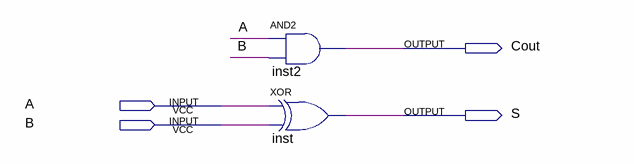
[diagram p0: schematic sheet]
// Quartus schematic HA.bdf as structural Verilog: 2 symbols, 4 pins
module HA (
  input  A,
  input  B,
  output Cout,
  output S
);

  and inst2 (Cout, A, B);
  xor inst (S, A, B);
endmodule
